# EAGLE schematic Cansat2019_1516_Payload_SectionA_v01 (EAGLE 7.3.0)
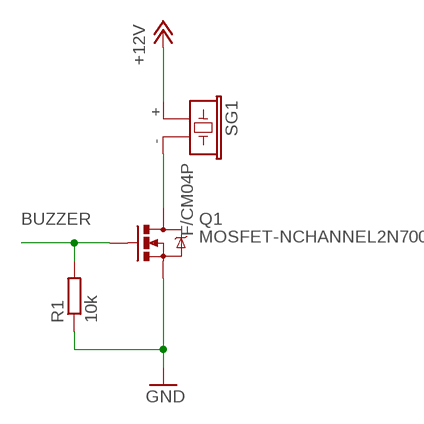
[diagram p0: schematic, sheet 1]

## Parts
Q1  MOSFET-NCHANNEL2N7000  [TO-92]
R1  10k  R-EU_0204/7  [0204/7]
SG1  F/CM04P  [F/CM04P]

## Nets
+12V: SG1.+
BUZZER: Q1.2(G) R1.2
GND: Q1.1(S) R1.1
N$1: Q1.3(D) SG1.-

## Library data of the parts
Q1 = SparkFun-DiscreteSemi:MOSFET-NCHANNEL: Common NMOSFET Parts MFG P/N Store ID Prod ID FDD8780 TRANS-09984 SI7820DN TRANS-11055 FDS6630A IC-08089 2N7002PW TRANS-11151 FQP30N06L COM-10213 TRANS-10060 BSS123LT1G TRANS-08345 BSS138 TRANS-00830 BS170 2N7000
R1 = rcl:R-EU_: RESISTOR, European symbol
SG1 = buzzer:F/CM04P: BUZZER Source: Buerklin; OC_FARNELL: unknown; OC_NEWARK: unknown